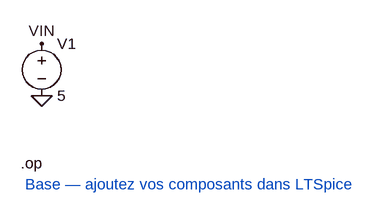
[diagram p0: schematic general.asc]
general.asc, the LTspice schematic file:
Version 4
SHEET 1 880 680
FLAG 80 96 VIN
FLAG 80 176 0
SYMBOL voltage 80 80 R0
WINDOW 123 0 0 Left 0
WINDOW 39 0 0 Left 0
SYMATTR InstName V1
SYMATTR Value 5
TEXT 48 280 Left 2 !.op
TEXT 48 312 Left 2 ; Base — ajoutez vos composants dans LTSpice

The netlist it stands for:
* general.asc
V1 VIN 0 5
.op
*  Base — ajoutez vos composants dans LTSpice
.backanno
.end